# EAGLE schematic extBoard (EAGLE 7.5.0)
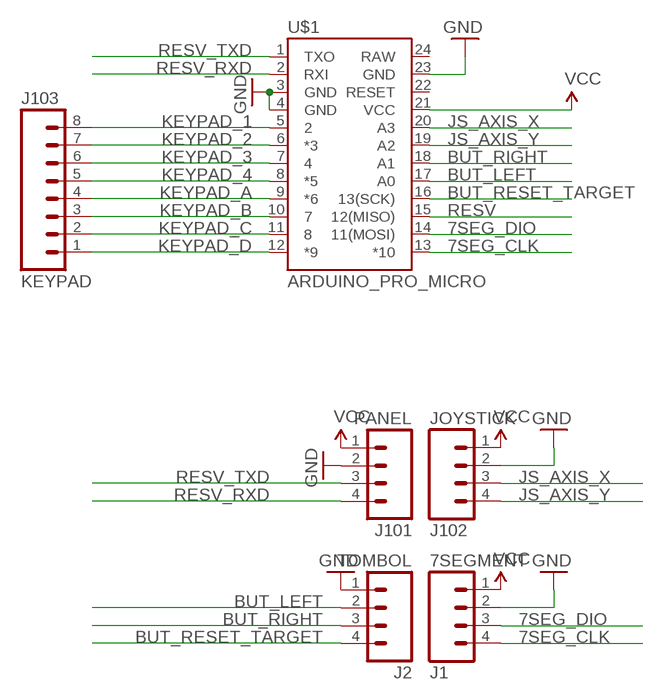
[diagram p0: schematic, sheet 1]

## Parts
J1  7SEGMENT  M04-XH-RA  [XH-4-RA]
J2  TOMBOL  M04-XH-RA  [XH-4-RA]
J101  PANEL  M04-XH-RA  [XH-4-RA]
J102  JOYSTICK  M04-XH-RA  [XH-4-RA]
J103  KEYPAD  M08-XH-RA  [XH-8-RA]
U$1  ARDUINO_PRO_MICRO  [ARDUINO_PRO_MICRO]

## Nets
7SEG_CLK: J1.4 U$1.13(*10)
7SEG_DIO: J1.3 U$1.14(11(MOSI))
BUT_LEFT: J2.2 U$1.17(A0)
BUT_RESET_TARGET: J2.4 U$1.16(13(SCK))
BUT_RIGHT: J2.3 U$1.18(A1)
GND: J1.2 J2.1 J101.2 J102.2 U$1.3(GND) U$1.4(GND) U$1.23(GND)
JS_AXIS_X: J102.3 U$1.20(A3)
JS_AXIS_Y: J102.4 U$1.19(A2)
KEYPAD_1: J103.8 U$1.5
KEYPAD_2: J103.7 U$1.6(*3)
KEYPAD_3: J103.6 U$1.7
KEYPAD_4: J103.5 U$1.8(*5)
KEYPAD_A: J103.4 U$1.9(*6)
KEYPAD_B: J103.3 U$1.10
KEYPAD_C: J103.2 U$1.11
KEYPAD_D: J103.1 U$1.12(*9)
RESV: U$1.15(12(MISO))
RESV_RXD: J101.4 U$1.2(RXI)
RESV_TXD: J101.3 U$1.1(TXO)
VCC: J1.1 J101.1 J102.1 U$1.21(VCC)
Unconnected: U$1.22(RESET) U$1.24(RAW)

## Library data of the parts
J1 J2 J101 J102 = SparkFun-Connectors:M04: Header 4 Standard 4-pin 0.1" header. Use with straight break away headers (SKU : PRT-00116), right angle break away headers (PRT-00553), swiss pins (PRT-00743), machine pins (PRT-00117), and female headers (PRT-00115). Molex polarized connector foot print use with SKU : PRT-08231 with associated crimp pins and housings. 1MM SMD Version SKU: PRT-10208
J103 = SparkFun-Connectors:M08: Header 8 Standard 8-pin 0.1" header. Use with straight break away headers (SKU : PRT-00116), right angle break away headers (PRT-00553), swiss pins (PRT-00743), machine pins (PRT-00117), and female headers (PRT-00115).
U$1 = SparkFun-Boards:ARDUINO_PRO_MICRO

## Net classes
0 default: width 0.406 mm, drill 0.59 mm, clearance 0.305 mm